# EAGLE design oled_pmic (EAGLE 9.5.2)

## Sheet 1 of 2
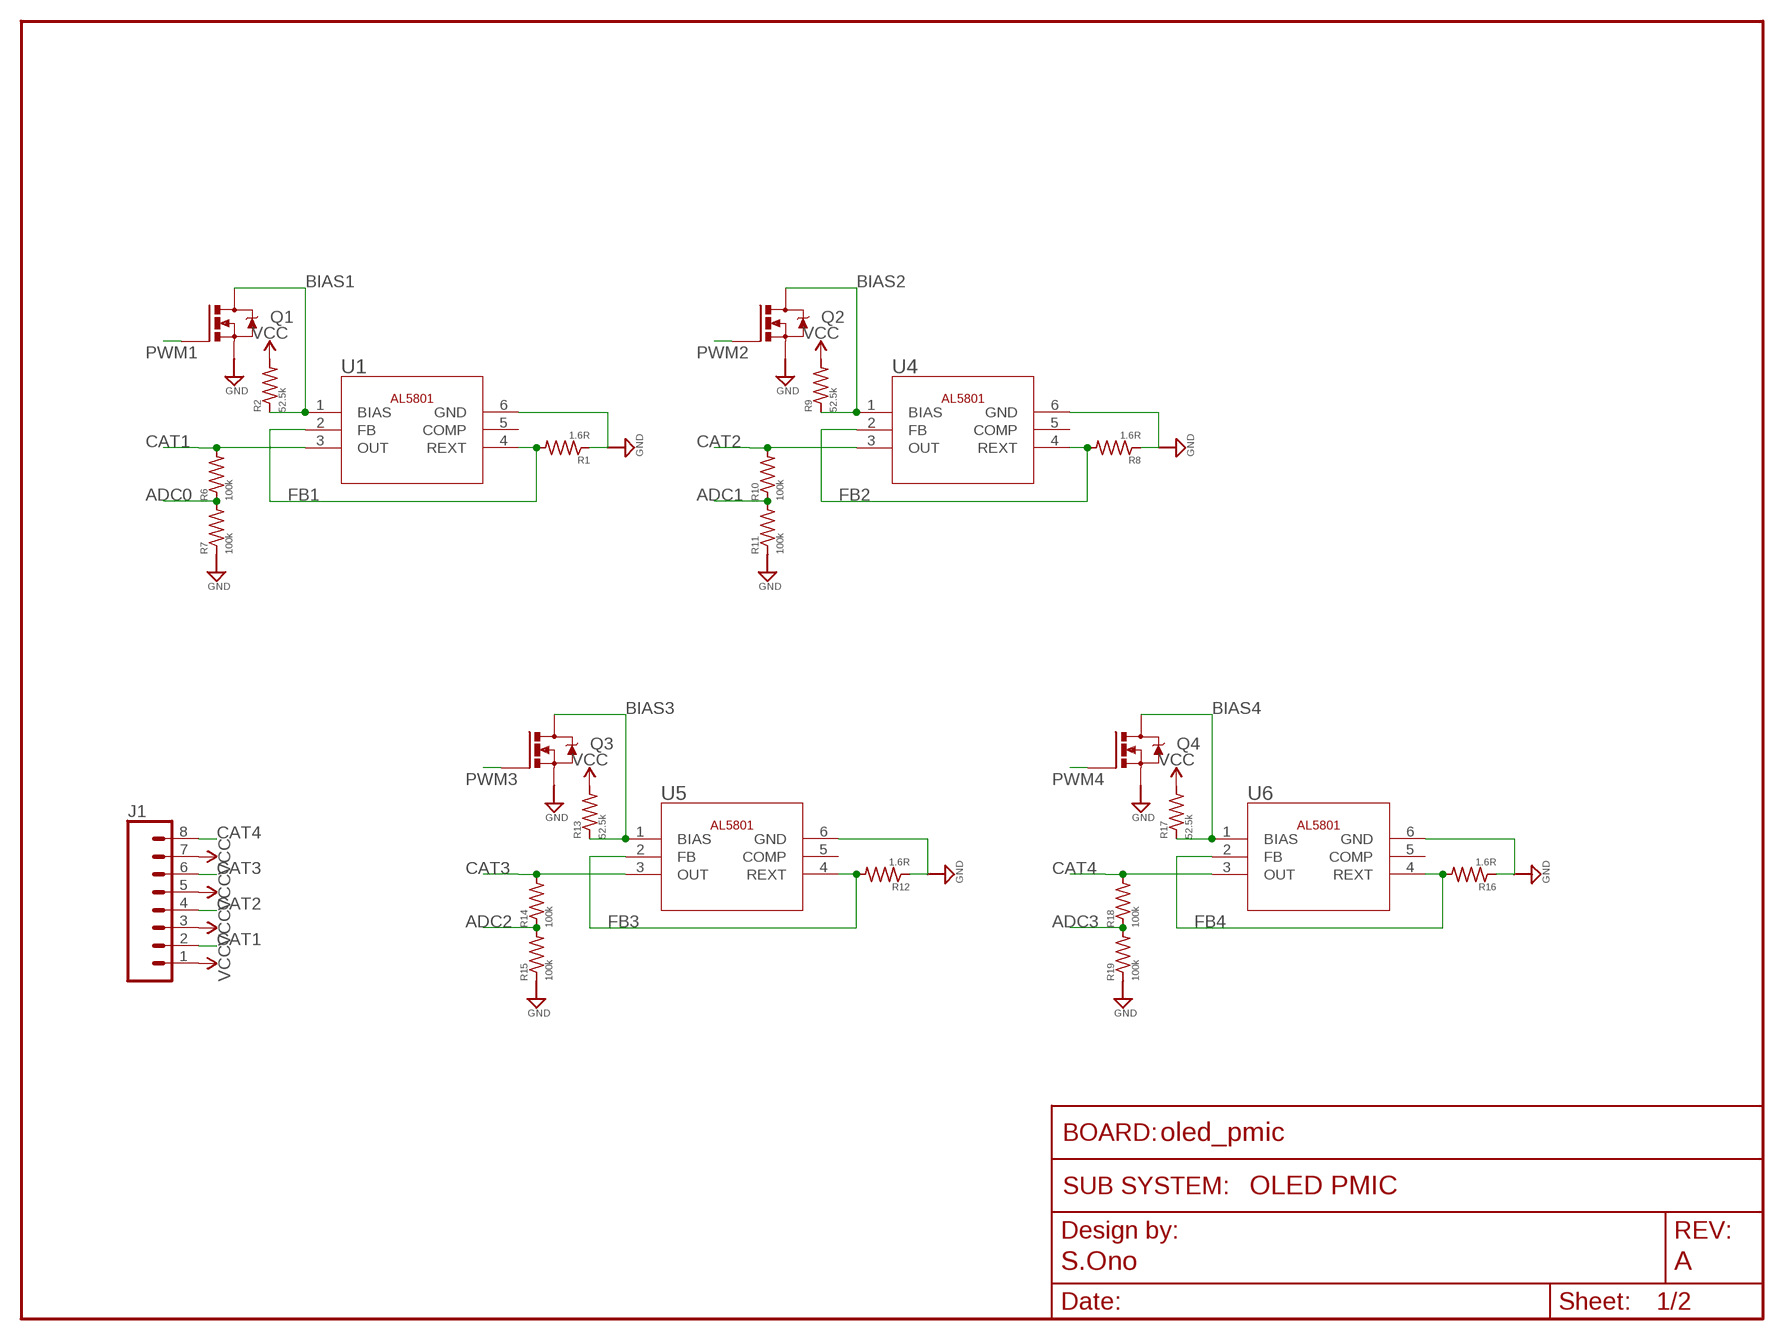
[diagram p0: schematic, sheet 1]
FRAME1 (FRAME_SCHEMATIC): AUTHOR: S.Ono; REV: A; SUBSYSTEM_NAME: OLED PMIC

### Parts
J1  CONN_08"  [1X08]
Q1  N-CHANNEL-MOSFETSOT23-3  [SOT23-3]
Q2  N-CHANNEL-MOSFETSOT23-3  [SOT23-3]
Q3  N-CHANNEL-MOSFETSOT23-3  [SOT23-3]
Q4  N-CHANNEL-MOSFETSOT23-3  [SOT23-3]
R1  1.6R  R-US_0603  [0603-RES]
R2  52.5k  R-US_0603  [0603-RES]
R6  100k  R-US_R0402  [R0402]
R7  100k  R-US_R0402  [R0402]
R8  1.6R  R-US_0603  [0603-RES]
R9  52.5k  R-US_0603  [0603-RES]
R10  100k  R-US_R0402  [R0402]
R11  100k  R-US_R0402  [R0402]
R12  1.6R  R-US_0603  [0603-RES]
R13  52.5k  R-US_0603  [0603-RES]
R14  100k  R-US_R0402  [R0402]
R15  100k  R-US_R0402  [R0402]
R16  1.6R  R-US_0603  [0603-RES]
R17  52.5k  R-US_0603  [0603-RES]
R18  100k  R-US_R0402  [R0402]
R19  100k  R-US_R0402  [R0402]
U1  AL5801W6-7  [SOT26]
U4  AL5801W6-7  [SOT26]
U5  AL5801W6-7  [SOT26]
U6  AL5801W6-7  [SOT26]

### Nets
ADC0: R6.1 R7.2 ; also sheet 2
ADC1: R10.1 R11.2 ; also sheet 2
ADC2: R14.1 R15.2 ; also sheet 2
ADC3: R18.1 R19.2 ; also sheet 2
BIAS1: Q1.3(D) R2.1 U1.1(BIAS)
BIAS2: Q2.3(D) R9.1 U4.1(BIAS)
BIAS3: Q3.3(D) R13.1 U5.1(BIAS)
BIAS4: Q4.3(D) R17.1 U6.1(BIAS)
CAT1: J1.2 R6.2 U1.3(OUT)
CAT2: J1.4 R10.2 U4.3(OUT)
CAT3: J1.6 R14.2 U5.3(OUT)
CAT4: J1.8 R18.2 U6.3(OUT)
FB1: R1.2 U1.2(FB) U1.4(REXT)
FB2: R8.2 U4.2(FB) U4.4(REXT)
FB3: R12.2 U5.2(FB) U5.4(REXT)
FB4: R16.2 U6.2(FB) U6.4(REXT)
GND: Q1.2(S) Q2.2(S) Q3.2(S) Q4.2(S) R1.1 R7.1 R8.1 R11.1 R12.1 R15.1 R16.1 R19.1 U1.6(GND) U4.6(GND) U5.6(GND) U6.6(GND) ; also sheet 2
PWM1: Q1.1(G) ; also sheet 2
PWM2: Q2.1(G) ; also sheet 2
PWM3: Q3.1(G) ; also sheet 2
PWM4: Q4.1(G) ; also sheet 2
VCC: J1.1 J1.3 J1.5 J1.7 R2.2 R9.2 R13.2 R17.2 ; also sheet 2
Unconnected: U1.5(COMP) U4.5(COMP) U5.5(COMP) U6.5(COMP)

## Sheet 2 of 2
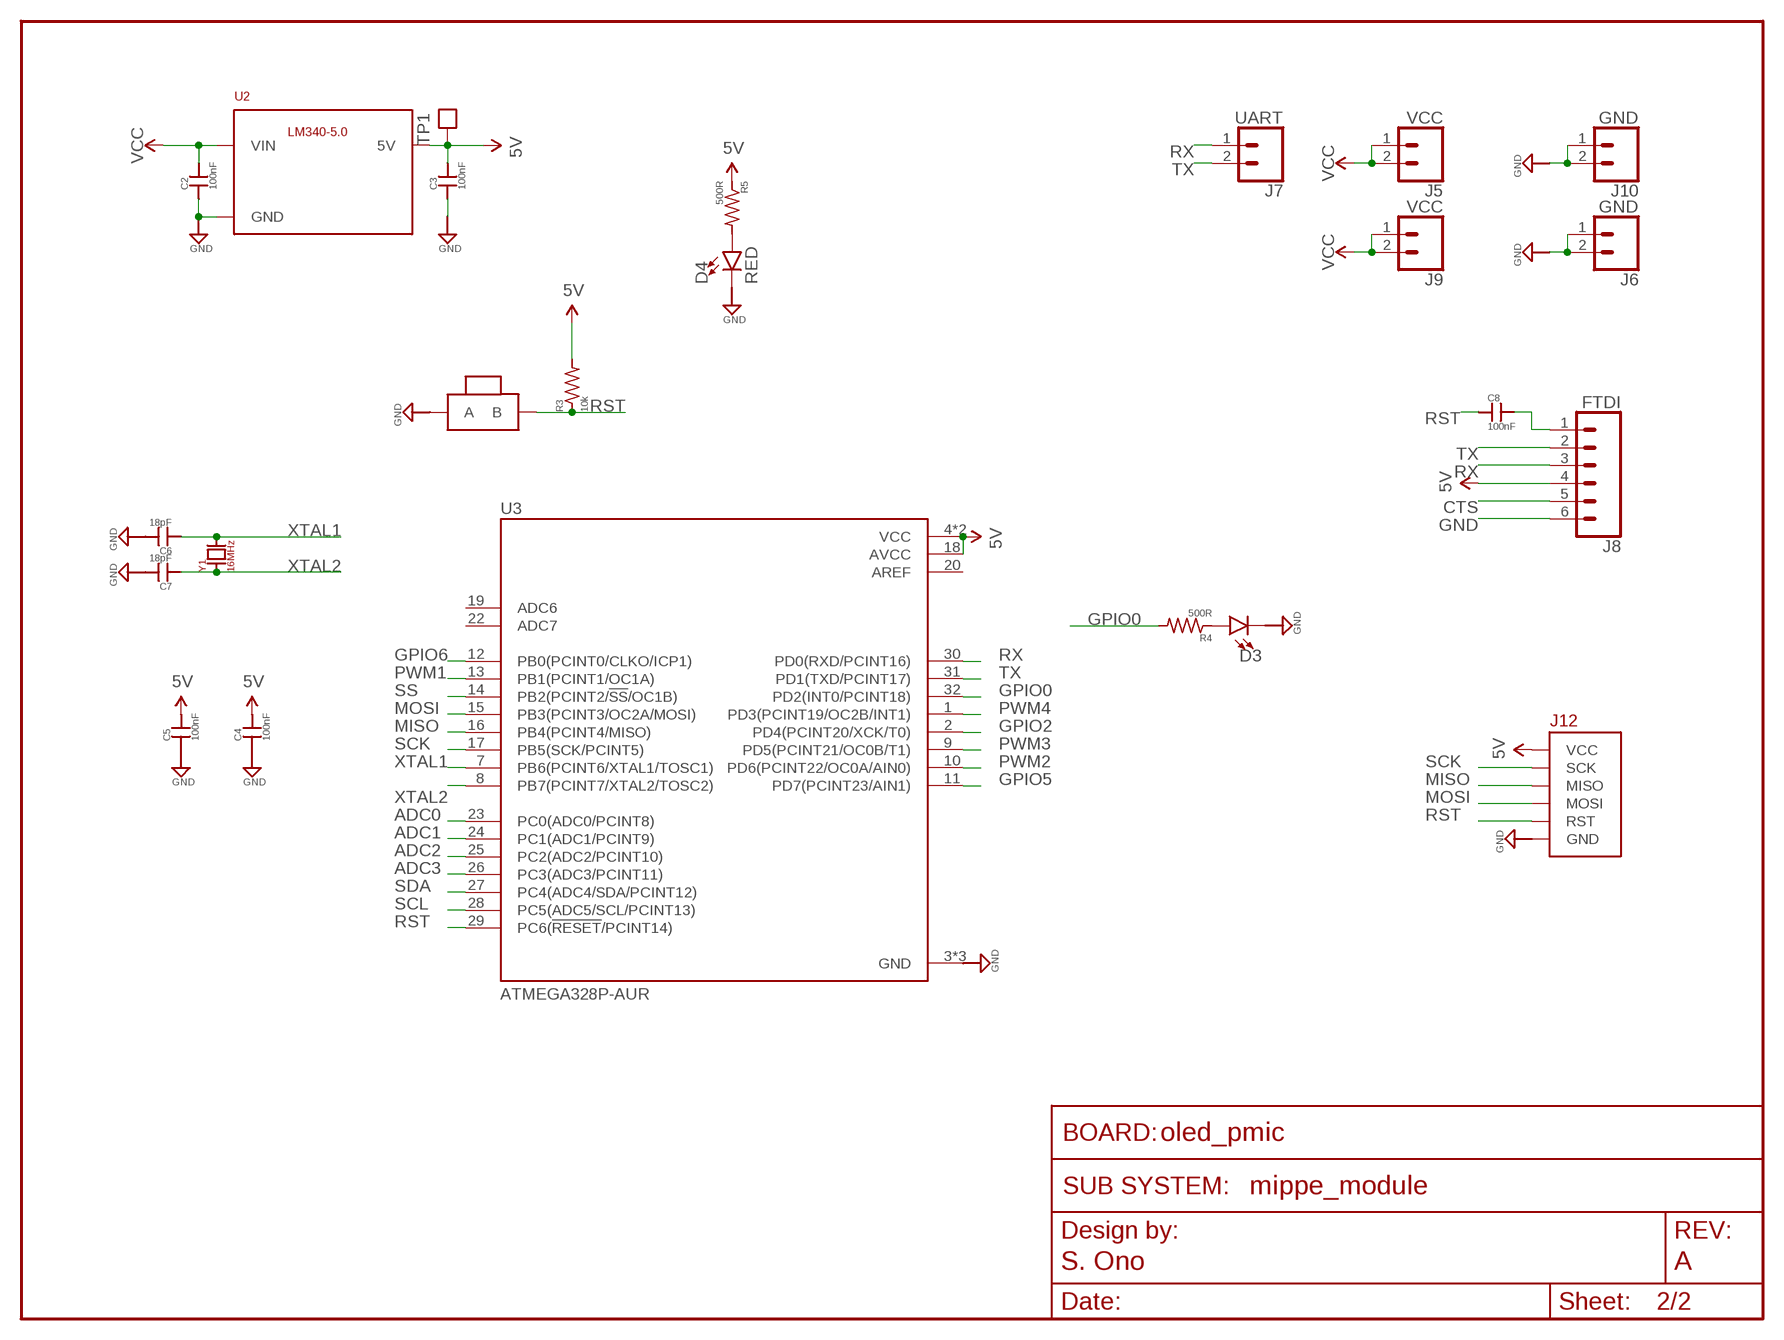
[diagram p1: schematic, sheet 2]
FRAME2 (FRAME_SCHEMATIC): AUTHOR: S. Ono; REV: A; SUBSYSTEM_NAME: mippe_module

### Parts
C2  100nF  CAP0402-CAP  [0402-CAP]
C3  100nF  CAP0402-CAP  [0402-CAP]
C4  100nF  CAP0402-CAP  [0402-CAP]
C5  100nF  CAP0402-CAP  [0402-CAP]
C6  18pF  CAP0402-CAP  [0402-CAP]
C7  18pF  CAP0402-CAP  [0402-CAP]
C8  100nF  CAP0402-CAP  [0402-CAP]
D3  LED0603  [LED-0603]
D4  RED  LED0603  [LED-0603]
J5  VCC  CONN_02  [1X02]
J6  GND  CONN_02  [1X02]
J7  UART  CONN_02  [1X02]
J8  FTDI  CONN_06NO_SILK_FEMALE_PTH  [1X06_NO_SILK]
J9  VCC  CONN_02  [1X02]
J10  GND  CONN_02  [1X02]
J12  BURNIN  [BURNIN]
R3  10k  R-US_R0402  [R0402]
R4  500R  R-US_R0402  [R0402]
R5  500R  R-US_R0402  [R0402]
SW1  BTN-PTS810  [BTN_PTS810]
TP1  TEST_POINTTHRU  [TEST_POINT]
U2  LM340MPX-5.0230  [SOT230P700X180-4N]
U3  ATMEGA328P-AUR  [QFP80P900X900X120-32N]
Y1  16MHz  CRYSTAL_SMOL  [XTAL500X320X130N]

### Nets
5V: C3.2 C4.2 C5.2 J8.4 J12.3.3V(VCC) R3.2 R5.1 TP1.1 U2.3(5V) U3.4(VCC) U3.6(VCC) U3.18(AVCC)
ADC0: U3.23(PC0(ADC0/PCINT8)) ; also sheet 1
ADC1: U3.24(PC1(ADC1/PCINT9)) ; also sheet 1
ADC2: U3.25(PC2(ADC2/PCINT10)) ; also sheet 1
ADC3: U3.26(PC3(ADC3/PCINT11)) ; also sheet 1
CTS: J8.5
GND: C2.1 C3.1 C4.1 C5.1 C6.2 C7.2 D3.C D4.C J6.1 J6.2 J8.6 J10.1 J10.2 J12.GND SW1.1(A) SW1.2(A) U2.2(GND) U2.4(GND) U3.3(GND) U3.5(GND) U3.21(GND) ; also sheet 1
GPIO0: R4.2 U3.32(PD2(INT0/PCINT18))
GPIO2: U3.2(PD4(PCINT20/XCK/T0))
GPIO5: U3.11(PD7(PCINT23/AIN1))
GPIO6: U3.12(PB0(PCINT0/CLKO/ICP1))
MISO: J12.MISO U3.16(PB4(PCINT4/MISO))
MOSI: J12.MOSI U3.15(PB3(PCINT3/OC2A/MOSI))
N$1: D3.A R4.1
N$5: D4.A R5.2
N$6: C8.2 J8.1
PWM1: U3.13(PB1(PCINT1/OC1A)) ; also sheet 1
PWM2: U3.10(PD6(PCINT22/OC0A/AIN0)) ; also sheet 1
PWM3: U3.9(PD5(PCINT21/OC0B/T1)) ; also sheet 1
PWM4: U3.1(PD3(PCINT19/OC2B/INT1)) ; also sheet 1
RST: C8.1 J12.RST R3.1 SW1.3(B) SW1.4(B) U3.29(PC6(!RESET!/PCINT14))
RX: J7.1 J8.3 U3.30(PD0(RXD/PCINT16))
SCK: J12.SCK U3.17(PB5(SCK/PCINT5))
SCL: U3.28(PC5(ADC5/SCL/PCINT13))
SDA: U3.27(PC4(ADC4/SDA/PCINT12))
SS: U3.14(PB2(PCINT2/!SS!/OC1B))
TX: J7.2 J8.2 U3.31(PD1(TXD/PCINT17))
VCC: C2.2 J5.1 J5.2 J9.1 J9.2 U2.1(VIN) ; also sheet 1
XTAL1: C6.1 U3.7(PB6(PCINT6/XTAL1/TOSC1)) Y1.2(B)
XTAL2: C7.1 U3.8(PB7(PCINT7/XTAL2/TOSC2)) Y1.1(A)
Unconnected: U3.19(ADC6) U3.22(ADC7)

## Power pins joined to a net without a drawn wire
AREF: U3.20(AREF)

## Library data of the parts
C2-C8 = scono:CAP: Capacitor Standard 0603 ceramic capacitor, and 0.1" leaded capacitor.; PIE-INT-REF-NUM: CAPACITOR-GENERIC
D3 D4 = scono:LED: https://www.digikey.com/products/en/optoelectronics/led-indication-discrete/105?k=&pkeyword=&pv7=2&pv1989=0&pv16=5&FV=ffe00069&quantity=0&ColumnSort=0&page=1&pageSize=25
J1 = scono:CONN_08: Multi connection point. Often used as Generic Header-pin footprint for 0.1 inch spaced/style header connections On any of the 0.1 inch spaced packages, you can populate with these: Break Away Headers - Straight <https://www.sparkfun.com/products/116> (PRT-00116) Break Away Male Headers - Right Angle <https://www.sparkfun.com/products/553> (PRT-00553) Female Headers <https://www.sparkfun.com/products/115> (PRT-00115) Break Away Headers - Machine Pin <https://www.sparkfun.com/products/117> (PRT-00117) Break Away Female Headers - Swiss Machine Pin <https://www.sparkfun.com/products/743> (PRT-00743) Arduino Stackable Header - 8 Pin <https://www.sparkfun.com/products/9279> (PRT-09279) For SCREWTERMINALS and SPRING TERMINALS visit here: Screw Terimnals on SparkFun.com <https://www.sparkfun.com/search/results?term=Screw+Terminals> (5mm/3.5mm/2.54mm spacing) This device is also useful as a general connection point to wire up your design to another part of your project. Our various solder wires solder well into these plated through hole pads. Hook-Up Wire - Assortment (Stranded, 22 AWG) <https://www.sparkfun.com/products/11375> (PRT-11375) Hook-Up Wire - Assortment (Solid Core, 22 AWG) <https://www.sparkfun.com/products/11367> (PRT-11367) View the entire wire category on our website here <https://www.sparkfun.com/categories/141> Special notes: Molex polarized connector foot print use with SKU : PRT-08231 with associated crimp pins and housings. 1MM SMD Version SKU: PRT-10208 NOTES ON THE VARIANTS LOCK and LOCK_LONGPADS... This footprint was designed to help hold the alignment of a through-hole component (i.e. 6-pin header) while soldering it into place. You may notice that each hole has been shifted either up or down by 0.005 of an inch from it's more standard position (which is a perfectly straight line). This slight alteration caused the pins (the squares in the middle) to touch the edges of the holes. Because they are alternating, it causes a "brace" to hold the component in place. 0.005 has proven to be the perfect amount of "off-center" position when using our standard breakaway headers. Although looks a little odd when you look at the bare footprint, once you have a header in there, the alteration is very hard to notice. Also,if you push a header all the way into place, it is covered up entirely on the bottom side.; PROD_ID: CONN-08438
J5-J7 J9 J10 = scono:CONN_02: Multi connection point. Often used as Generic Header-pin footprint for 0.1 inch spaced/style header connections On any of the 0.1 inch spaced packages, you can populate with these: Break Away Headers - Straight <https://www.sparkfun.com/products/116> (PRT-00116) Break Away Male Headers - Right Angle <https://www.sparkfun.com/products/553> (PRT-00553) Female Headers <https://www.sparkfun.com/products/115> (PRT-00115) Break Away Headers - Machine Pin <https://www.sparkfun.com/products/117> (PRT-00117) Break Away Female Headers - Swiss Machine Pin <https://www.sparkfun.com/products/743> (PRT-00743) For SCREWTERMINALS and SPRING TERMINALS visit here: Screw Terimnals on SparkFun.com <https://www.sparkfun.com/search/results?term=Screw+Terminals> (5mm/3.5mm/2.54mm spacing) This device is also useful as a general connection point to wire up your design to another part of your project. Our various solder wires solder well into these plated through hole pads. Hook-Up Wire - Assortment (Stranded, 22 AWG) <https://www.sparkfun.com/products/11375> (PRT-11375) Hook-Up Wire - Assortment (Solid Core, 22 AWG) <https://www.sparkfun.com/products/11367> (PRT-11367) View the entire wire category on our website here <https://www.sparkfun.com/categories/141> Special notes: Molex polarized connector foot print use with: PRT-08233 with associated crimp pins and housings. 2.54_SCREWTERM for use with PRT-10571. 3.5mm Screw Terminal footprints for PRT-08084 5mm Screw Terminal footprints for use with PRT-08432
J8 = scono:CONN_06: Multi connection point. Often used as Generic Header-pin footprint for 0.1 inch spaced/style header connections On any of the 0.1 inch spaced packages, you can populate with these: Break Away Headers - Straight <https://www.sparkfun.com/products/116> (PRT-00116) Break Away Male Headers - Right Angle <https://www.sparkfun.com/products/553> (PRT-00553) Female Headers <https://www.sparkfun.com/products/115> (PRT-00115) Break Away Headers - Machine Pin <https://www.sparkfun.com/products/117> (PRT-00117) Break Away Female Headers - Swiss Machine Pin <https://www.sparkfun.com/products/743> (PRT-00743) Arduino Stackable Header - 6 Pin <https://www.sparkfun.com/products/9280> (PRT-09280) For SCREWTERMINALS and SPRING TERMINALS visit here: Screw Terimnals on SparkFun.com <https://www.sparkfun.com/search/results?term=Screw+Terminals> (5mm/3.5mm/2.54mm spacing) This device is also useful as a general connection point to wire up your design to another part of your project. Our various solder wires solder well into these plated through hole pads. Hook-Up Wire - Assortment (Stranded, 22 AWG) <https://www.sparkfun.com/products/11375> (PRT-11375) Hook-Up Wire - Assortment (Solid Core, 22 AWG) <https://www.sparkfun.com/products/11367> (PRT-11367) View the entire wire category on our website here <https://www.sparkfun.com/categories/141>; PROD_ID: CONN-08437
J12 = scono:BURNIN
Q1-Q4 = scono:N-CHANNEL-MOSFET: N-channel TrenchMOS (TM) logic level FET Source: SOT23-3: http://www.nxp.com/documents/data_sheet/BSS123.pdf SOT669: http://www.nxp.com/documents/data_sheet/PH7030L.pdf 8-VSONPWR: https://www.digikey.com/product-detail/en/texas-instruments/CSD18504Q5A/296-30572-1-ND/3478032
R1-R19 = scono:R-US_: RESISTOR, American symbol
SW1 = scono:BTN-PTS810: https://www.digikey.com/product-detail/en/c-k/PTS810-SJM-250-SMTR-LFS/CKN10502CT-ND/4176673
TP1 = scono:TEST_POINT: 1206 Test point for O-scope probes. For A106146CT-ND or similar
U1 U4-U6 = scono:AL5801W6-7; BUILT_BY: EMA_UL_Team; MANUFACTURER_PART_NUMBER: AL5801W6-7; VENDOR: Diodes Inc
U2 = scono:LM340MPX-5.0
U3 = scono:ATMEGA328P-AUR: ATmega328P Series 8 Bit 2 kB RAM 32 kB Flash SMT Microcontroller - TQFP-32; DESCRIPTION: ATmega328P Series 8 Bit 2 kB RAM 32 kB Flash SMT Microcontroller - TQFP-32; DIGI-KEY_PART_NUMBER: ATMEGA328P-AURCT-ND; DIGI-KEY_PURCHASE_URL: https://www.digikey.com/product-detail/en/microchip-technology/ATMEGA328P-AUR/ATMEGA328P-AURCT-ND/3789455?utm_source=snapeda&utm_medium=aggregator&utm_campaign=symbol; MF: Microchip; MP: ATMEGA328P-AUR; PACKAGE: TQFP-32 Microchip
Y1 = scono:CRYSTAL

## Board
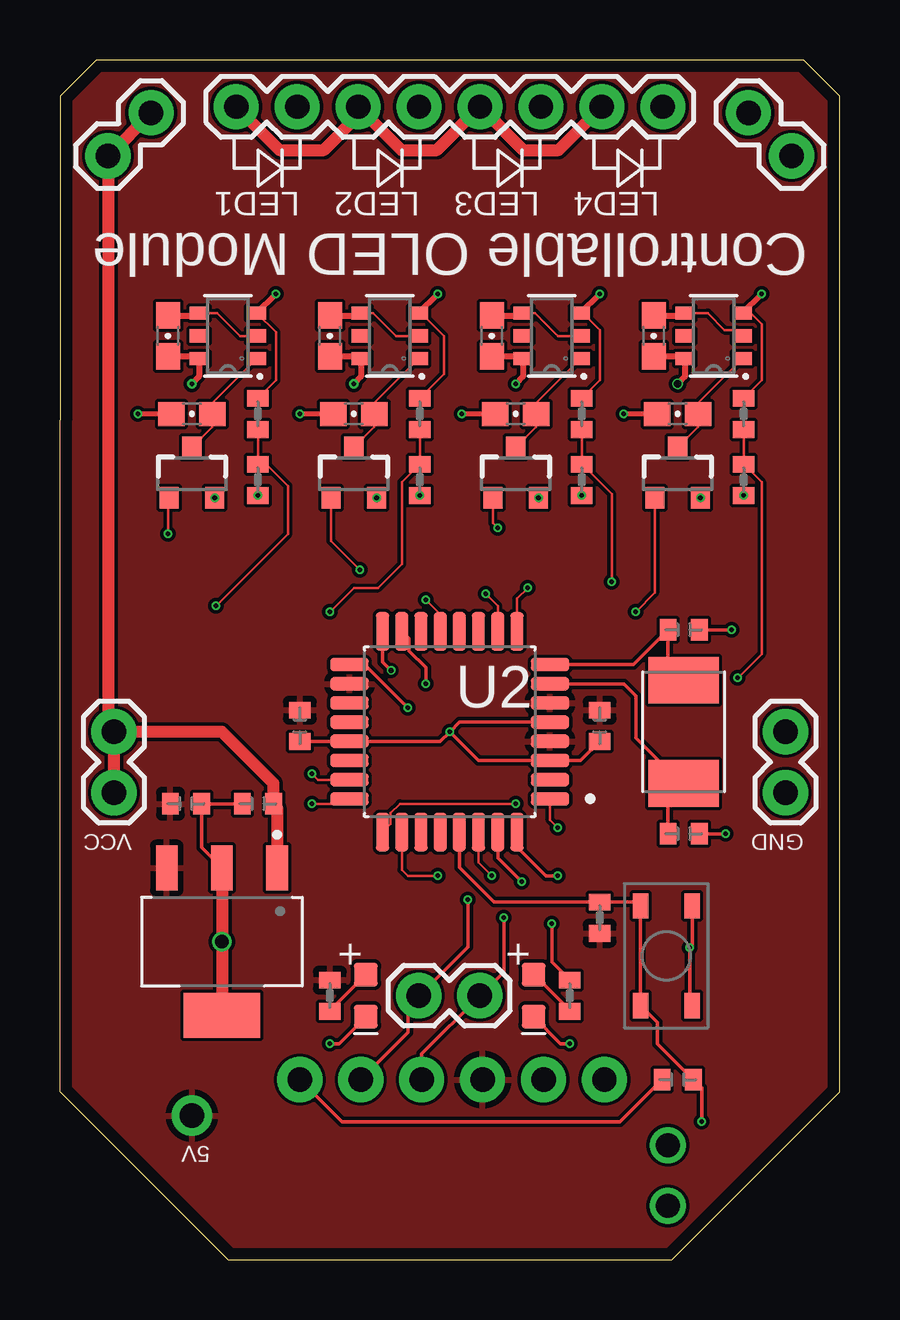
[diagram p2: board, top side]
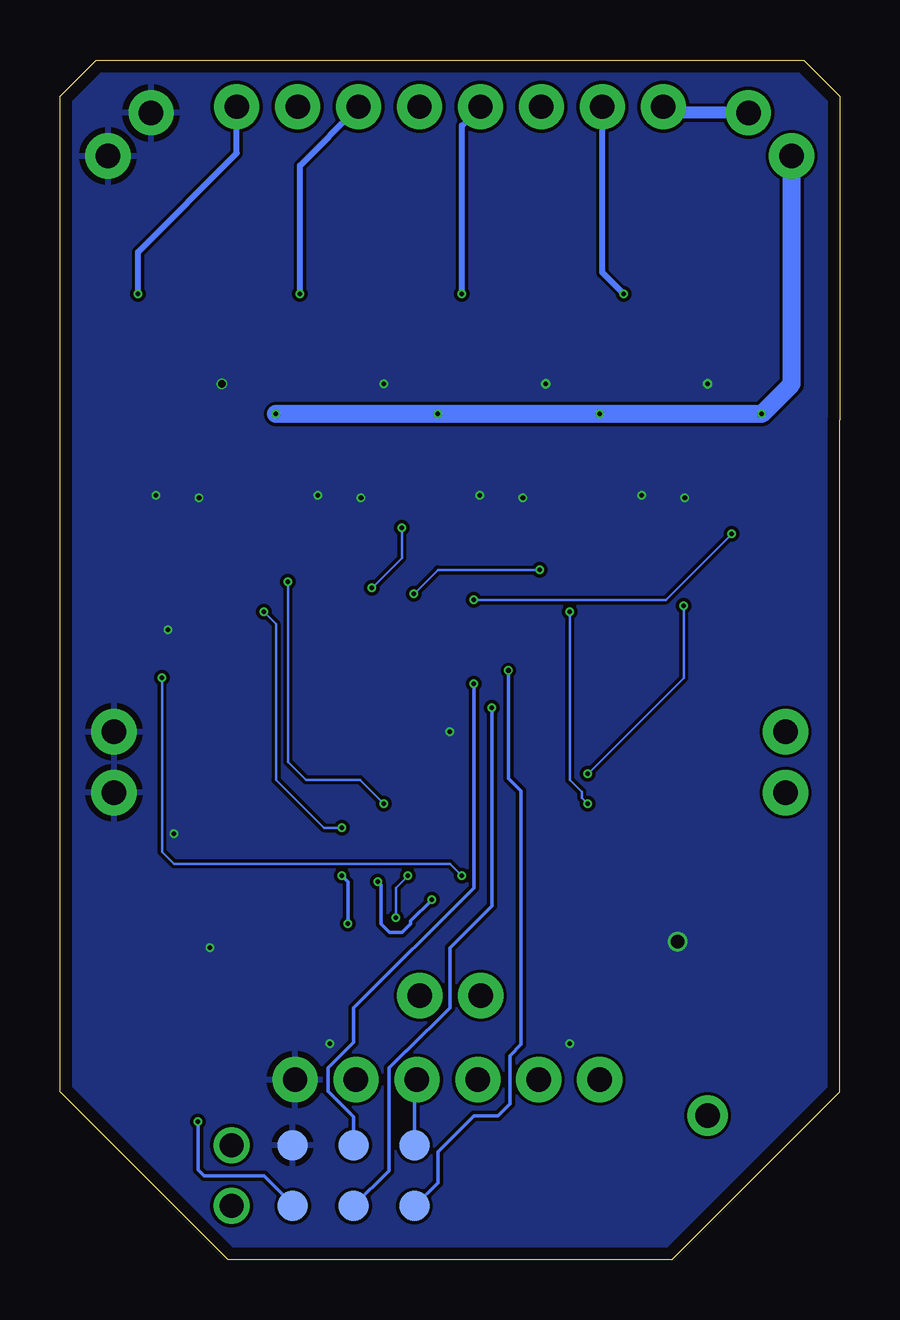
[diagram p3: board, bottom side, seen from below]

Size 32.5 x 50 mm. Coordinates in mm from the lower left corner, seen from the top.
Outline: 7,0 0,7 0,35 0,48.5 1.5,50 31,50 32.5,48.5 32.5,30.5 32.5,7 25.5,0 7,0
Copper layers (1*16): Top 2mil / dielectric 9mil / Bottom 2mil
Design rules "scono": minimum track width 3.5mil, minimum drill 0.2mm, track to track 5.5mil, track to pad 5.5mil, pad to pad 5.5mil, via to via 5.5mil, smd to smd 0mil, copper to edge 0.5mm, drill to drill 0.5mm, minimum pad ring 3mil, minimum via ring 3mil, stop-mask expansion 3mil, vias tented up to drill 0mil, thermal gap 10mil

### Footprints (pad centres in the part's own frame; a part is rotated, then mirrored left to right if it is on the bottom)
0402-CAP = smd 0.7 x 0.9: 1 -0.65,0; 2 0.65,0
LED-0603 = smd 1 x 1: A 0.877,0; C -0.877,0
1X08 = drill 1.016 pad 1.88: 1 0,0; 2 2.54,0; 3 5.08,0; 4 7.62,0; 5 10.16,0; 6 12.7,0; 7 15.24,0; 8 17.78,0
1X02 = drill 1.016 pad 1.88: 1 0,0; 2 2.54,0
1X06_NO_SILK = drill 1.016 pad 1.88: 1 0,0; 2 2.54,0; 3 5.08,0; 4 7.62,0; 5 10.16,0; 6 12.7,0
BURNIN = smd 1.27 x 1.27 bottom: 3.3V 0,0; GND -5.08,0; MISO 0,2.54; MOSI -2.54,0; RST -5.08,2.54; SCK -2.54,2.54 | drill 1: P$7 -7.62,2.54; P$8 -7.62,0
SOT23-3 = smd 0.8 x 0.9: 1 -0.95,-1; 2 0.95,-1; 3 0,1.1
0603-RES = smd 1.1 x 1: 1 -0.85,0; 2 0.85,0
R0402 = smd 0.7 x 0.9: 1 -0.65,0; 2 0.65,0
BTN_PTS810 = smd 1.05 x 0.65: 1 -2.075,1.075; 2 2.075,1.075; 3 -2.075,-1.075; 4 2.075,-1.075
TEST_POINT = drill 1.016 pad 1.676: 1 0,0
SOT26 = smd 0.8 x 0.55: 1 -1.2,0.95; 2 -1.2,0; 3 -1.2,-0.95; 4 1.2,-0.95; 5 1.2,0; 6 1.2,0.95
SOT230P700X180-4N = smd 1.86 x 0.9: 1 -3.075,2.3; 2 -3.075,0; 3 -3.075,-2.3 | smd 1.86 x 3.19: 4 3.075,0
QFP80P900X900X120-32N = smd 1.6 x 0.55: 1 -4.18,2.8; 2 -4.18,2; 3 -4.18,1.2; 4 -4.18,0.4; 5 -4.18,-0.4; 6 -4.18,-1.2; 7 -4.18,-2; 8 -4.18,-2.8; 17 4.18,-2.8; 18 4.18,-2; 19 4.18,-1.2; 20 4.18,-0.4; 21 4.18,0.4; 22 4.18,1.2; 23 4.18,2; 24 4.18,2.8 | smd 0.55 x 1.6: 9 -2.8,-4.18; 10 -2,-4.18; 11 -1.2,-4.18; 12 -0.4,-4.18; 13 0.4,-4.18; 14 1.2,-4.18; 15 2,-4.18; 16 2.8,-4.18; 25 2.8,4.18; 26 2,4.18; 27 1.2,4.18; 28 0.4,4.18; 29 -0.4,4.18; 30 -1.2,4.18; 31 -2,4.18; 32 -2.8,4.18
XTAL500X320X130N = smd 1.95 x 2.95: 1 -2.15,0; 2 2.15,0

### Placement (x,y rotation side)
C2  8.25,19 0 top
C3  5.25,19 180 top
C4  10,22.25 90 top
C5  22.5,22.25 90 top
C6  26,17.75 0 top
C7  26,26.25 0 top
C8  25.75,7.5 180 top
D3  19.75,11 90 top
D4  12.75,11 90 top
J1  7.35,48.05 0 top
J5  2.25,22 270 top
J6  30.25,22 270 top
J7  17.5,11 180 top
J8  10,7.5 0 top
J9  2,46 45 top
J10  30.5,46 135 top
J12  17.72,4.77 180 top
Q1  5.5,32.75 0 top
Q2  12.25,32.75 0 top
Q3  19,32.75 0 top
Q4  25.75,32.75 0 top
R1  4.5,38.5 90 top
R2  5.5,35.25 180 top
R3  22.5,14.25 270 top
R4  21.25,11 90 top
R5  11.25,11 270 top
R6  8.25,35.25 90 top
R7  8.25,32.5 90 top
R8  11.25,38.5 90 top
R9  12.25,35.25 180 top
R10  15,35.25 90 top
R11  15,32.5 90 top
R12  18,38.5 90 top
R13  19,35.25 180 top
R14  21.75,35.25 90 top
R15  21.75,32.5 90 top
R16  24.75,38.5 90 top
R17  25.75,35.25 180 top
R18  28.5,35.25 90 top
R19  28.5,32.5 90 top
SW1  25.28,12.66 270 top
TP1  5.5,6 0 top
U1  7,38.5 180 top
U2  6.75,13.25 270 top
U3  16.25,22 180 top
U4  13.75,38.5 180 top
U5  20.5,38.5 180 top
U6  27.25,38.5 180 top
Y1  26,22 270 top

### Tracks (layer width: path | path; a pad name or v marks a point on that pad's centre or on a via)
5V
  Bottom 0.152: J12.3.3V 17.72,7.4 J8.4
  pour Top: 36.75,-1.25 -7.75,-1.25 -7.75,50.75 36.75,50.75
ADC0  (via drill 0.2)
  Top 0.1: U3.23 10.75,20 v10.5,20.25 | v6.5,27.25 9.5,30.25 9.5,32.25 8.6,33.15 R7.2 R6.1
  Bottom 0.1: v10.5,20.25 6.5,24.25 v6.5,27.25
ADC1  (via drill 0.2)
  Top 0.1: U3.24 11.87,19 v10.5,19 | v11.25,27 12.25,28 13.25,28 14.25,29 14.25,32.4 R11.2 R10.1
  Bottom 0.1: v10.5,19 10.75,19.25 10.75,19.5 11.25,20 v11.25,27
ADC2  (via drill 0.2)
  Top 0.1: U3.25 13.79,18.16 13.79,18.61 14.17,19 v19,19 | v23,28.25 23,31.9 R15.2 R14.1
  Bottom 0.1: v19,19 20,20 22.25,20 23,20.75 v23,28.25
ADC3  (via drill 0.2)
  Top 0.1: v28.25,24.25 29.25,25.25 29.25,32 29.25,32.4 R19.2 R18.1 | U3.26 14.25,16.25 14.5,16 v15.75,16
  Bottom 0.1: v28.25,24.25 28.25,17 27.75,16.5 16.25,16.5 v15.75,16
BIAS1
  Top 0.1: U1.1 6.35,35.7 R2.1 6.35,34.7 Q1.3
BIAS2
  Top 0.1: U4.1 13.1,35.7 R9.1 13.1,34.7 Q2.3
BIAS3
  Top 0.1: U5.1 19.85,35.7 R13.1 19.85,34.7 Q3.3
BIAS4
  Top 0.1: Q4.3 26.6,34.7 R17.1 26.6,35.7 U6.1
CAT1  (via drill 0.2 pad 0.3)
  Top 0.1: R6.2 9,36.65 9,38.65 U1.3
  Top 0.25: U1.3 v9,40.25
  Bottom 0.25: v9,40.25 9.89,41.14 J1.2
CAT2  (via drill 0.2 pad 0.3)
  Top 0.1: R10.2 16,36.9 16,38.5 15.05,39.45 U4.3
  Top 0.25: U4.3 v15.75,40.25
  Bottom 0.25: v15.75,40.25 15.75,47.27 J1.4
CAT3  (via drill 0.2 pad 0.3)
  Top 0.1: R14.2 22.5,36.65 22.5,38.75 21.8,39.45 U5.3
  Top 0.25: U5.3 v22.5,40.25
  Bottom 0.25: v22.5,40.25 22.5,45.6 J1.6
CAT4  (via drill 0.2 pad 0.3)
  Top 0.1: R18.2 29.25,36.65 29.25,39 28.8,39.45 U6.3
  Top 0.25: U6.3 v29.25,40.25
  Bottom 0.25: v29.25,40.25 29.25,42 25.13,46.12 J1.8
FB1
  Top 0.1: 5.7,39.35 U1.4 6.55,39.45 7.5,38.5 U1.2
  Top 0.25: R1.2 5.7,39.35
FB2
  Top 0.1: 12.45,39.35 U4.4 13.05,39.45 14,38.5 U4.2
  Top 0.25: R8.2 12.45,39.35
FB3
  Top 0.1: 19.2,39.35 U5.4 19.8,39.45 20.75,38.5 U5.2
  Top 0.25: R12.2 19.2,39.35
FB4
  Top 0.1: 25.95,39.35 U6.4 27,39.45 27.7,38.75 28.2,38.75 U6.2
  Top 0.25: R16.2 25.95,39.35
GND  (via drill 0.2, 0.2 pad 0.4, 0.3, 0.55)
  Top 0.1: U6.6 26.05,37.5 25.9,37.65 | U5.6 19.3,37.5 19.15,37.65 | U1.6 5.8,37.5 5.65,37.65 | U4.6 12.55,37.5 12.4,37.65
  Top 0.152: U2.2 5.9,17.18 C3.1 C2.1 | C4.1 U3.21 15.85,21.6 v16.25,22 | C7.2 v28,26.25 | C5.1 21.7,20.8 U3.3 17.45,20.8 v16.25,22 | U3.5 16.65,22.4 v16.25,22 | C6.2 v27.75,17.75 | SW1.1 26.36,13.11 v26.25,13 26.25,10.69 SW1.2 | D3.C 20.87,9 v21.25,9 | D4.C 11.63,9 v11.25,9
  Top 0.25: 19.3,37.5 19.3,36.8 v19,36.5 | 5.8,37.5 5.8,36.8 v5.5,36.5 | 12.55,37.5 12.55,36.8 v12.25,36.5 | R1.1 5.65,37.65 | R8.1 12.4,37.65 | R12.1 19.15,37.65 | R16.1 25.9,37.65 | U6.6 26.05,36.8 v25.75,36.5
  Top 0.508: U2.2 v6.75,13.25 U2.4
  other vias: 19.95,31.75 21.75,31.85 26.7,31.75 28.5,31.85 15,31.85 13.2,31.75 8.25,31.85 6.45,31.75
  pour Bottom: 36.75,-1.25 -7.75,-1.25 -7.75,50.75 36.75,50.75
GPIO0  (via drill 0.2)
  Top 0.152: R4.2 20.5,12.4 v20.5,14 | v20.75,16 20.25,16 19.05,17.2 U3.32
  Bottom 0.152: v20.5,14 20.5,15.75 v20.75,16
MISO  (via drill 0.2)
  Top 0.152: U3.16 13.45,24.91 v13.8,24.55
  Bottom 0.152: v13.8,24.55 13.8,20.05 13.38,19.62 13.28,19.53 13.28,8.97 13.75,8.5 13.75,6.5 14.25,6 15.25,6 16.75,4.5 16.75,3.2 J12.MISO
MOSI  (via drill 0.2)
  Top 0.152: U3.15 14.55,25.88 14.55,25.37 15.25,24.67 v15.25,24
  Bottom 0.152: J12.MOSI 20.26,5.95 21.33,7.02 21.33,7.98 20.26,9.05 20.26,10.49 15.25,15.5 v15.25,24
N$1
  Top 0.152: D3.A 21.25,10.38 R4.1
N$5
  Top 0.152: D4.A 11.25,10.38 R5.2
N$6
  Top 0.152: J8.1 11.75,5.75 23.35,5.75 C8.2
PWM1  (via drill 0.2)
  Top 0.1: U3.13 15.85,26.9 v15.25,27.5 | v4.5,30.25 4.5,31.7 Q1.1
  Bottom 0.1: v15.25,27.5 7.25,27.5 v4.5,30.25
PWM2  (via drill 0.2)
  Top 0.1: U3.10 18.25,27.25 v17.75,27.75 | v12.5,28.75 11.3,29.95 Q2.1
  Bottom 0.1: v17.75,27.75 16.75,28.75 v12.5,28.75
PWM3  (via drill 0.2)
  Top 0.1: U3.9 19.05,27.55 v19.5,28 | v18.25,30.5 18.05,30.7 Q3.1
  Bottom 0.1: v19.5,28 18.25,29.25 v18.25,30.5
PWM4  (via drill 0.2)
  Top 0.1: Q4.1 24.8,27.8 v24,27 | v20.75,18 20.43,18.32 U3.1
  Bottom 0.1: v24,27 23.5,26.5 23.5,20 21.5,18 v20.75,18
RST  (via drill 0.2)
  Top 0.152: 24.09,14.85 24.04,14.9 R3.1 18.1,14.9 16.65,16.35 U3.29 | 24.09,14.85 SW1.3 | SW1.3 SW1.4 24.9,9.89 24.9,9 C8.1 26.75,7.15 v26.75,5.75 | SW1.3 24.09,14.85
  Bottom 0.152: J12.RST 22.8,2.3 24,3.5 26.5,3.5 26.75,3.75 v26.75,5.75
RX  (via drill 0.2)
  Top 0.1: U3.30 17.45,16.55 v18,16
  Top 0.152: v18.5,14.25 18.5,12 J7.1 15.08,8.58 J8.3
  Bottom 0.1: v18,16 18.5,15.5 v18.5,14.25
SCK  (via drill 0.2)
  Top 0.152: U3.17 12.7,24.8 v14.5,23
  Bottom 0.152: J12.SCK 18.79,3.7 18.79,7.98 18.1,8.67 18.08,8.67 16.25,10.5 16.25,13 14.5,14.75 v14.5,23
TX  (via drill 0.2)
  Top 0.152: v19.25,15.75 18.25,16.75 U3.31 | J8.2 14.5,9.46 14.5,10.54 J7.2 17,13.04 v17,15
  Bottom 0.152: v19.25,15.75 19.11,15.61 19.11,14 18.75,13.64 18.25,13.64 17.89,14 17.89,14.11 v17,15
VCC  (via drill 0.2)
  Top 0.2: R9.2 v10,35.25 | R13.2 v16.75,35.25 | R17.2 v23.5,35.25 | R2.2 v3.25,35.25
  Top 0.5: J1.1 9.15,46.25 11,46.25 12.43,47.68 J1.3 14.23,46.25 15.71,46.25 J1.5 19.31,46.25 20.79,46.25 J1.7
  Top 0.508: U2.1 9.05,18.85 C2.2 8.9,19.85 6.75,22 J5.1 | J5.2 J5.1 | J9.2 J9.1 2,22.25 J5.1
  Bottom 0.5: J9.2 7.1,47.8 J1.1
  Bottom 0.75: v23.5,35.25 v16.75,35.25 v10,35.25 v3.25,35.25 2,36.5 J9.1
XTAL1
  Top 0.152: U3.7 23.5,24 24,23.5 24,21.75 25.9,19.85 Y1.2 25.35,19.2 C6.1
XTAL2
  Top 0.152: U3.8 23.9,24.8 C7.1 25.35,24.8 Y1.1

### Text on the board
tPlace: LED1 | LED2 | LED3 | LED4 | Controllable OLED Module | VCC | GND
tNames: U2 | 5V